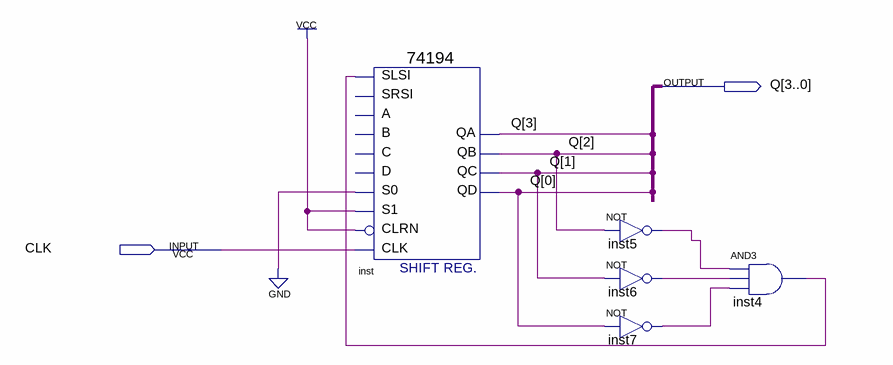
[diagram p0: schematic sheet]
// Quartus schematic leftin.bdf as structural Verilog: 5 symbols, 2 pins
module leftin (
  input  CLK,
  output [3:0] Q
);

  wire inst4_out, inst5_out, inst6_out, inst7_out;

  \74194  inst (
    .SLSI(inst4_out), .CLK(CLK), .CLRN(1'b1), .S1(1'b1), .S0(1'b0), .QA(Q[3]), .QB(Q[2]), .QC(Q[1]), .QD(Q[0]));  // open: SRSI, B, C, D, A
  not inst5 (inst5_out, Q[2]);
  not inst6 (inst6_out, Q[1]);
  not inst7 (inst7_out, Q[0]);
  and inst4 (inst4_out, inst5_out, inst6_out, inst7_out);
endmodule
